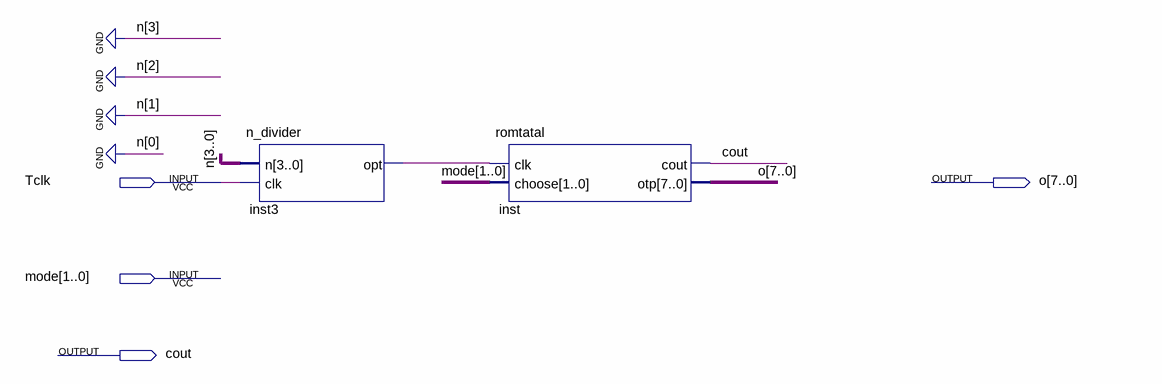
[diagram p0: schematic sheet]
// Quartus schematic test.bdf as structural Verilog: 2 symbols, 4 pins
module test (
  input  Tclk,
  input  [1:0] mode,
  output [7:0] o,
  output cout
);

  wire inst3_opt;

  n_divider inst3 (.n(4'b0000), .clk(Tclk), .opt(inst3_opt));
  romtatal inst (.clk(inst3_opt), .choose(mode), .cout(cout), .otp(o));
endmodule
